# EAGLE design sega (EAGLE 8.0.0)
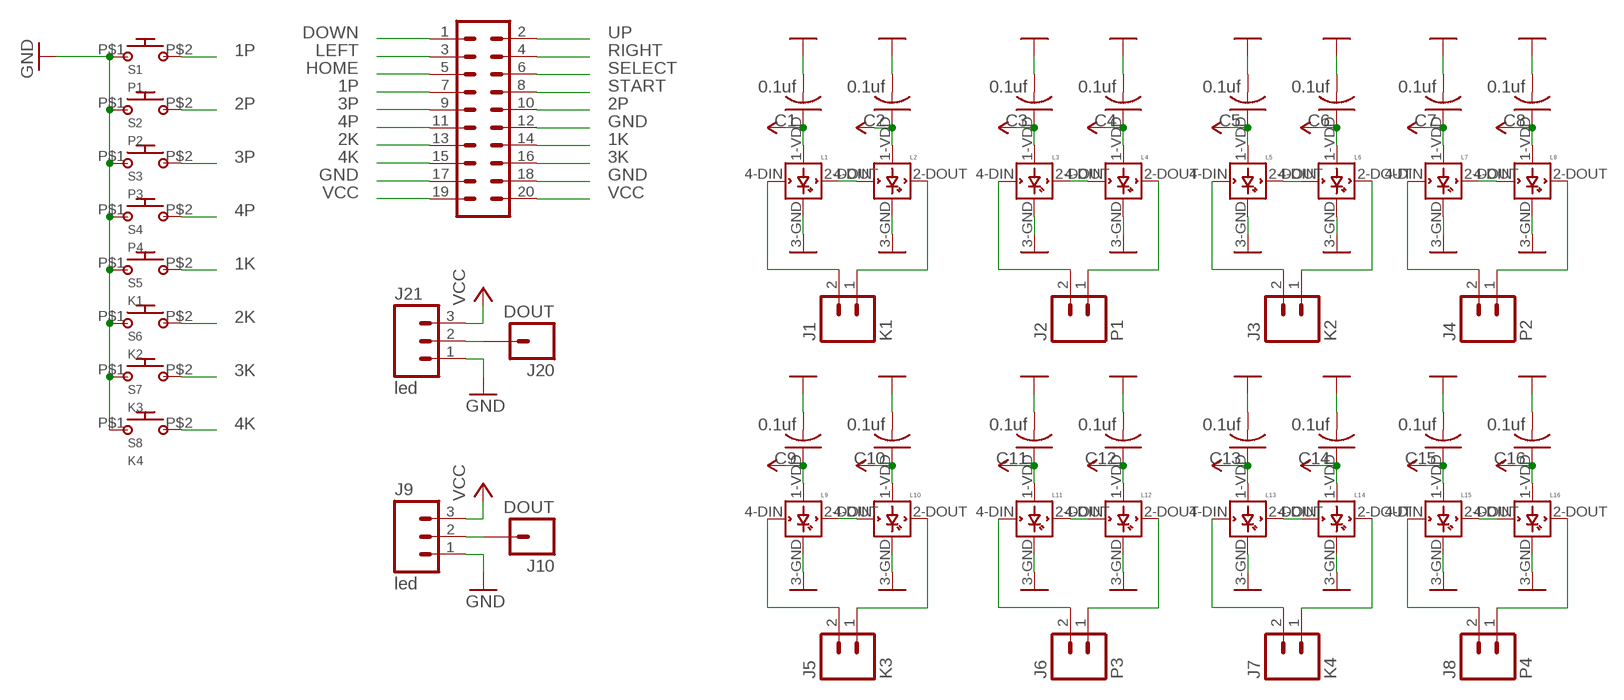
[diagram p0: schematic, sheet 1]

## Parts
C1  0.1uf  C-USC0603K  [C0603K]
C2  0.1uf  C-USC0603K  [C0603K]
C3  0.1uf  C-USC0603K  [C0603K]
C4  0.1uf  C-USC0603K  [C0603K]
C5  0.1uf  C-USC0603K  [C0603K]
C6  0.1uf  C-USC0603K  [C0603K]
C7  0.1uf  C-USC0603K  [C0603K]
C8  0.1uf  C-USC0603K  [C0603K]
C9  0.1uf  C-USC0603K  [C0603K]
C10  0.1uf  C-USC0603K  [C0603K]
C11  0.1uf  C-USC0603K  [C0603K]
C12  0.1uf  C-USC0603K  [C0603K]
C13  0.1uf  C-USC0603K  [C0603K]
C14  0.1uf  C-USC0603K  [C0603K]
C15  0.1uf  C-USC0603K  [C0603K]
C16  0.1uf  C-USC0603K  [C0603K]
J1  K1  M02PTH  [1X02]
J2  P1  M02PTH  [1X02]
J3  K2  M02PTH  [1X02]
J4  P2  M02PTH  [1X02]
J5  K3  M02PTH  [1X02]
J6  P3  M02PTH  [1X02]
J7  K4  M02PTH  [1X02]
J8  P4  M02PTH  [1X02]
J9  led  M03JST-PTH-VERT  [JST-3-PTH-VERT]
J10  DOUT  M01PTH  [1X01]
J20  DOUT  M01PTH  [1X01]
J21  led  M03JST-PTH-VERT  [JST-3-PTH-VERT]
L1  WS2812B  [WS2812B]
L2  WS2812B  [WS2812B]
L3  WS2812B  [WS2812B]
L4  WS2812B  [WS2812B]
L5  WS2812B  [WS2812B]
L6  WS2812B  [WS2812B]
L7  WS2812B  [WS2812B]
L8  WS2812B  [WS2812B]
L9  WS2812B  [WS2812B]
L10  WS2812B  [WS2812B]
L11  WS2812B  [WS2812B]
L12  WS2812B  [WS2812B]
L13  WS2812B  [WS2812B]
L14  WS2812B  [WS2812B]
L15  WS2812B  [WS2812B]
L16  WS2812B  [WS2812B]
S1  P1  SANWA_OBSC_24_CW  [SANWA_24MM]
S2  P2  SANWA_OBSC_24_CW  [SANWA_24MM]
S3  P3  SANWA_OBSC_24_CW  [SANWA_24MM]
S4  P4  SANWA_OBSC_24_CW  [SANWA_24MM]
S5  K1  SANWA_OBSC_24_CW  [SANWA_24MM]
S6  K2  SANWA_OBSC_24_CW  [SANWA_24MM]
S7  K3  SANWA_OBSC_24_CW  [SANWA_24MM]
S8  K4  SANWA_OBSC_24_CW  [SANWA_24MM]
U$1  M10X2ROUND_NOSILK  [2X10_ROUND_NOSILK]

## Nets
1K: S5.P$2 U$1.14
1P: S1.P$2 U$1.7
2K: S6.P$2 U$1.13
2P: S2.P$2 U$1.10
3K: S7.P$2 U$1.16
3P: S3.P$2 U$1.9
4K: S8.P$2 U$1.15
4P: S4.P$2 U$1.11
DOWN: U$1.1
GND: C1.2 C2.2 C3.2 C4.2 C5.2 C6.2 C7.2 C8.2 C9.2 C10.2 C11.2 C12.2 C13.2 C14.2 C15.2 C16.2 J9.1 J21.1 L1.3-GND(GND) L2.3-GND(GND) L3.3-GND(GND) L4.3-GND(GND) L5.3-GND(GND) L6.3-GND(GND) L7.3-GND(GND) L8.3-GND(GND) L9.3-GND(GND) L10.3-GND(GND) L11.3-GND(GND) L12.3-GND(GND) L13.3-GND(GND) L14.3-GND(GND) L15.3-GND(GND) L16.3-GND(GND) S1.P$1 S2.P$1 S3.P$1 S4.P$1 S5.P$1 S6.P$1 S7.P$1 S8.P$1 U$1.12 U$1.17 U$1.18
HOME: U$1.5
LEFT: U$1.3
N$1: J1.2 L1.4-DIN(DIN)
N$2: J1.1 L2.2-DOUT(DOUT)
N$3: L1.2-DOUT(DOUT) L2.4-DIN(DIN)
N$4: J20.1 J21.2
N$5: J2.2 L3.4-DIN(DIN)
N$6: J2.1 L4.2-DOUT(DOUT)
N$7: J3.2 L5.4-DIN(DIN)
N$8: L5.2-DOUT(DOUT) L6.4-DIN(DIN)
N$9: J3.1 L6.2-DOUT(DOUT)
N$10: J4.2 L7.4-DIN(DIN)
N$11: J4.1 L8.2-DOUT(DOUT)
N$12: J5.2 L9.4-DIN(DIN)
N$13: J5.1 L10.2-DOUT(DOUT)
N$14: J6.2 L11.4-DIN(DIN)
N$15: J6.1 L12.2-DOUT(DOUT)
N$16: J7.2 L13.4-DIN(DIN)
N$17: J7.1 L14.2-DOUT(DOUT)
N$18: L9.2-DOUT(DOUT) L10.4-DIN(DIN)
N$19: L11.2-DOUT(DOUT) L12.4-DIN(DIN)
N$20: L13.2-DOUT(DOUT) L14.4-DIN(DIN)
N$21: L15.2-DOUT(DOUT) L16.4-DIN(DIN)
N$22: L7.2-DOUT(DOUT) L8.4-DIN(DIN)
N$23: L3.2-DOUT(DOUT) L4.4-DIN(DIN)
N$24: J8.2 L15.4-DIN(DIN)
N$25: J8.1 L16.2-DOUT(DOUT)
N$27: J9.2 J10.1
RIGHT: U$1.4
SELECT: U$1.6
START: U$1.8
UP: U$1.2
VCC: C1.1 C2.1 C3.1 C4.1 C5.1 C6.1 C7.1 C8.1 C9.1 C10.1 C11.1 C12.1 C13.1 C14.1 C15.1 C16.1 J9.3 J21.3 L1.1-VDD(VDD) L2.1-VDD(VDD) L3.1-VDD(VDD) L4.1-VDD(VDD) L5.1-VDD(VDD) L6.1-VDD(VDD) L7.1-VDD(VDD) L8.1-VDD(VDD) L9.1-VDD(VDD) L10.1-VDD(VDD) L11.1-VDD(VDD) L12.1-VDD(VDD) L13.1-VDD(VDD) L14.1-VDD(VDD) L15.1-VDD(VDD) L16.1-VDD(VDD) U$1.19 U$1.20

## Library data of the parts
C1-C16 = rcl:C-US: CAPACITOR, American symbol
J1-J8 = SparkFun-Connectors:M02: Standard 2-pin 0.1" header. Use with - straight break away headers ( PRT-00116) - right angle break away headers (PRT-00553) - swiss pins (PRT-00743) - machine pins (PRT-00117) - female headers (PRT-00115) Molex polarized connector foot print use with: PRT-08233 with associated crimp pins and housings. 2.54_SCREWTERM for use with PRT-10571. 3.5mm Screw Terminal footprints for PRT-08084 5mm Screw Terminal footprints for use with PRT-08432
J9 J21 = SparkFun-Connectors:M03: Header 3 Standard 3-pin 0.1" header. Use with straight break away headers (SKU : PRT-00116), right angle break away headers (PRT-00553), swiss pins (PRT-00743), machine pins (PRT-00117), and female headers (PRT-00115). Molex polarized connector foot print use with SKU : PRT-08232 with associated crimp pins and housings.
J10 J20 = SparkFun-Connectors:M01: Header 1 Standard 1-pin 0.1" header. Use with straight break away headers (SKU : PRT-00116), right angle break away headers (PRT-00553), swiss pins (PRT-00743), machine pins (PRT-00117), and female headers (PRT-00115). SMTSO-256-ET is a "flush mount" nut for a 4-40 screw. The older package used to be too tight, and did not allow it to sit properly thru the drill hit. The latest (0.165DIA) fits nice and snug.
L1-L16 = adafruit:WS2812B
S1-S8 = arcaduinome:SANWA_OBSC_24_CW: Sanwa OBSC 24mm CW A 24mm arcade-style push button with clear casings and a white plunger.
U$1 = SparkFun-Connectors:M10X2: This was SPECIALLY designed to be used with our Graphic LCD Backpack. Be sure you want to use this! It is not only staggered on each line of header holes, but IT IS ALSO offset of the center point of the top and bottom lines by 5 mil. This causes the headers to lock into place on the "standard" footprint on the LCD screen. The extra squares on the tdocu layer are there simply to reference other pins (if you were to actually populate a longer header than ten long - this is what we do with the backpacks).

## Board
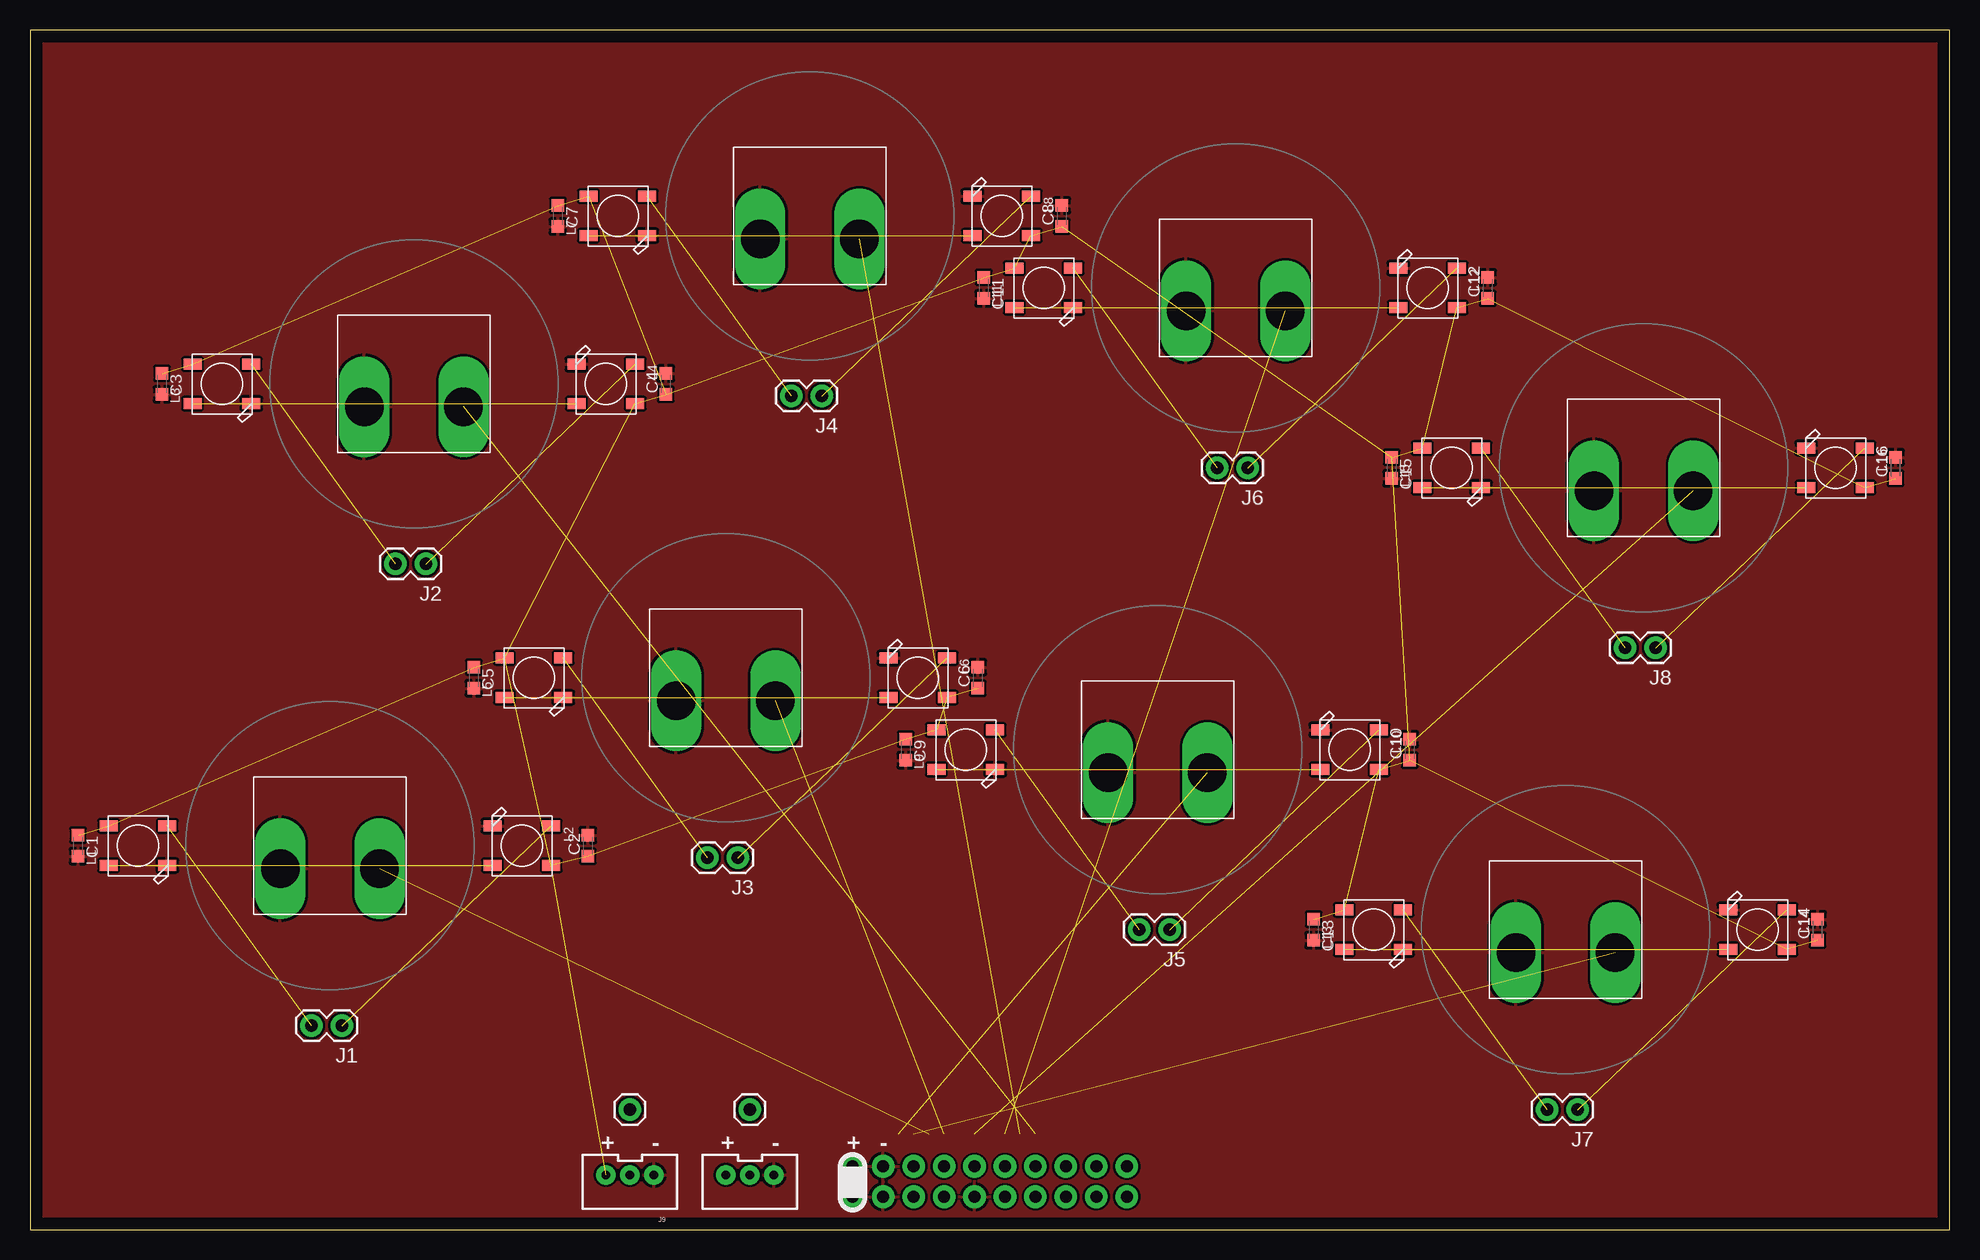
[diagram p1: board, top side]
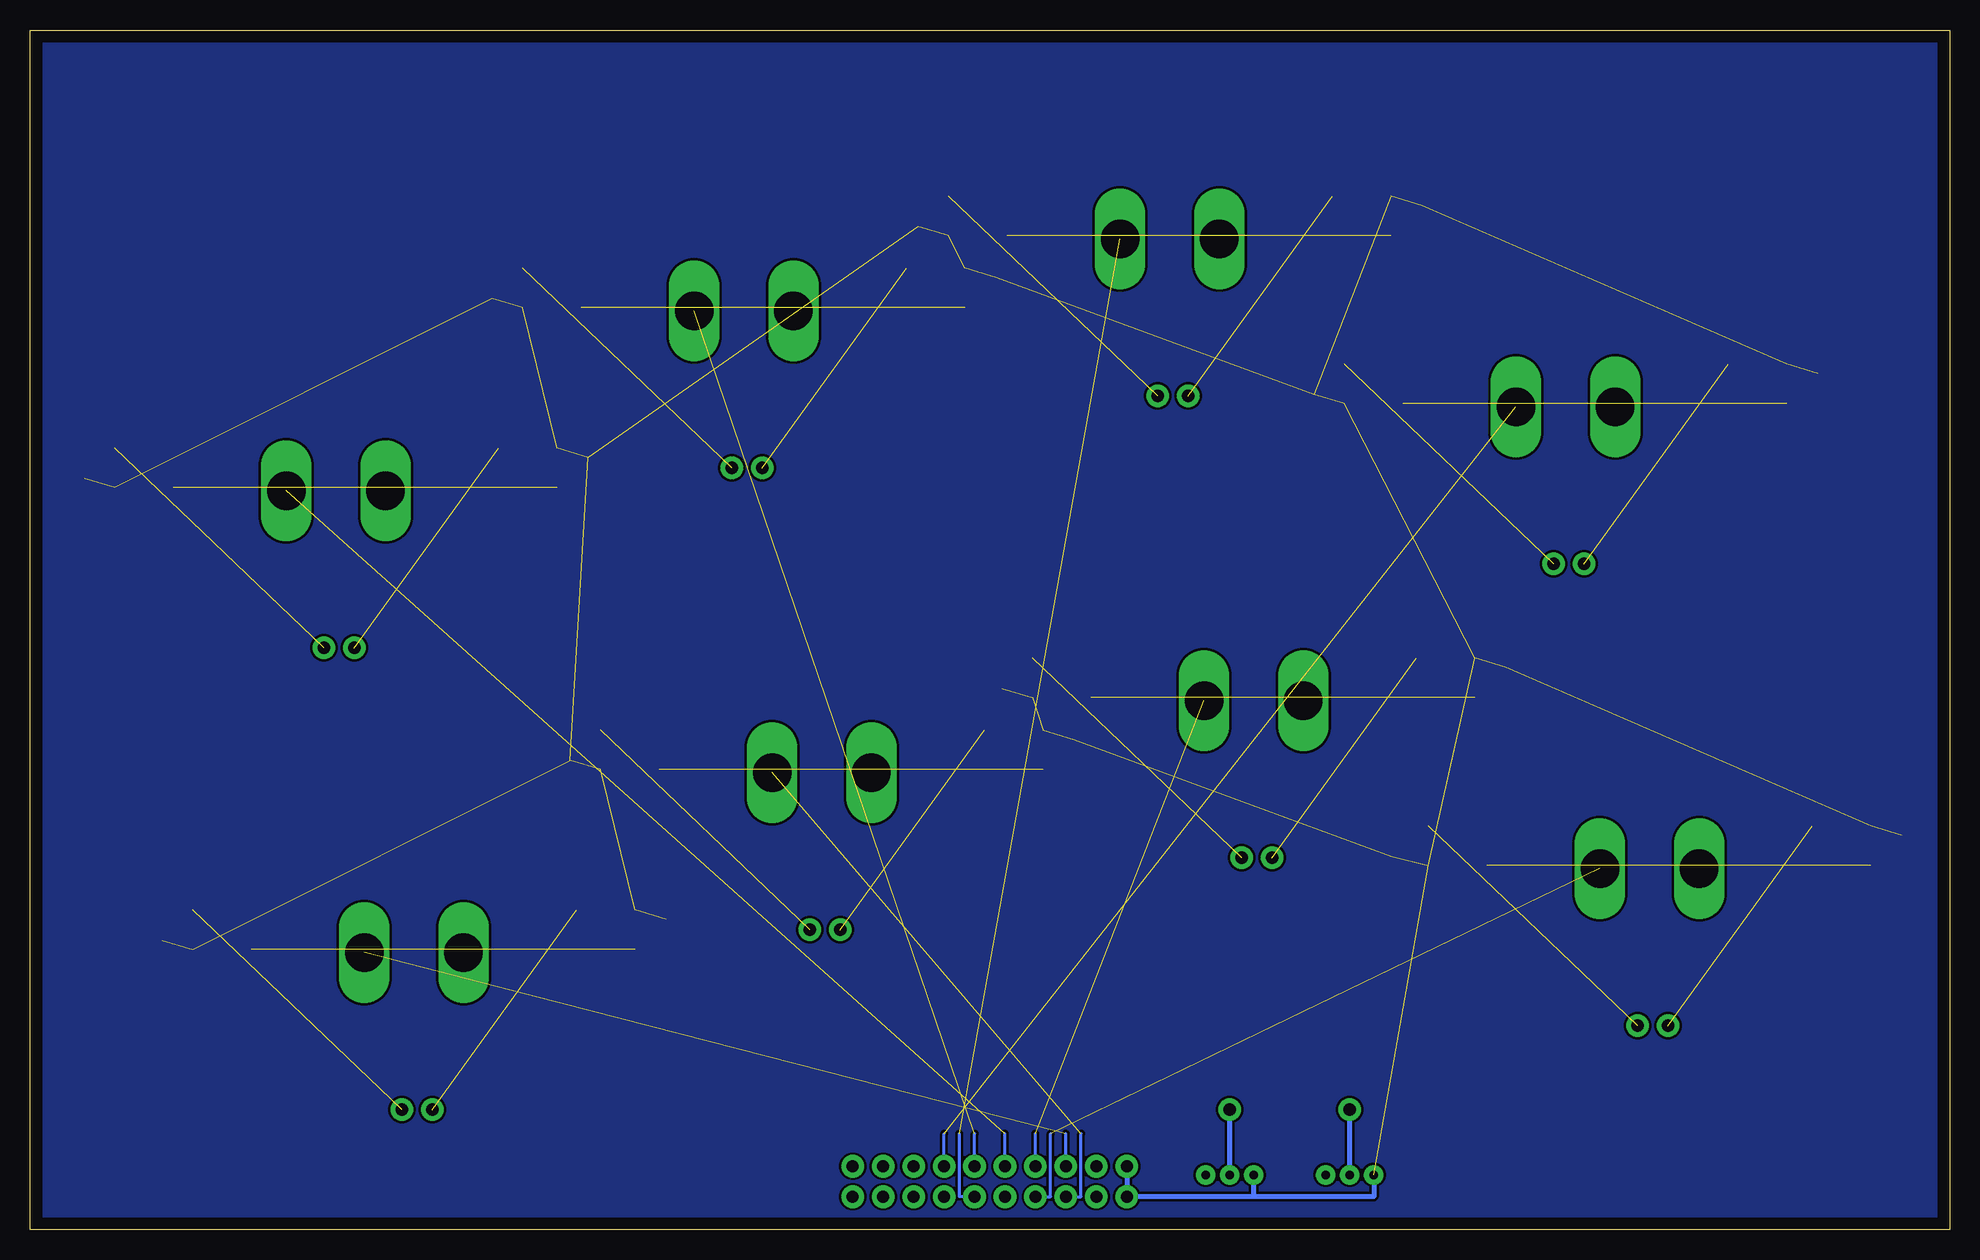
[diagram p2: board, bottom side, seen from below]

Size 160 x 100 mm. Coordinates in mm from the lower left corner, seen from the top.
Outline: 0,0 160,0 160,100 0,100 0,0
Copper layers (1*16): Top 0.035mm / dielectric 1.5mm / Bottom 0.035mm
Design rules "default": minimum track width 10mil, minimum drill 24mil, track to track 8mil, track to pad 8mil, pad to pad 8mil, via to via 8mil, smd to smd 8mil, copper to edge 40mil, drill to drill 8mil, minimum pad ring 10mil, minimum via ring 8mil, stop-mask expansion 4mil, vias tented up to drill 0mil, thermal gap 10mil

### Footprints (pad centres in the part's own frame; a part is rotated, then mirrored left to right if it is on the bottom)
C0603K = smd 1.05 x 1.08: 1 -0.875,0; 2 0.875,0
1X02 = drill 1.016 pad 1.88: 1 0,0; 2 2.54,0
JST-3-PTH-VERT = drill 0.7 pad 1.6: 1 -2,-0.55; 2 0,-0.55; 3 2,-0.55
1X01 = drill 1.016 pad 1.88: 1 0,0
WS2812B = smd 1.5 x 0.9: 1-VDD 2.45,-1.65; 2-DOUT 2.45,1.65; 3-GND -2.45,1.65; 4-DIN -2.45,-1.65
SANWA_24MM = drill 3.2 long: P$1 -4.128,-1.905; P$2 4.128,-1.905
2X10_ROUND_NOSILK = drill 1.016 pad 1.88: 1 -11.43,-1.27; 2 -11.43,1.27; 3 -8.89,-1.27; 4 -8.89,1.27; 5 -6.35,-1.27; 6 -6.35,1.27; 7 -3.81,-1.27; 8 -3.81,1.27; 9 -1.27,-1.27; 10 -1.27,1.27; 11 1.27,-1.27; 12 1.27,1.27; 13 3.81,-1.27; 14 3.81,1.27; 15 6.35,-1.27; 16 6.35,1.27; 17 8.89,-1.27; 18 8.89,1.27; 19 11.43,-1.27; 20 11.43,1.27

### Placement (x,y rotation side)
C1  4,32 270 top
C2  46.5,32 90 top
C3  11,70.5 270 top
C4  53,70.5 90 top
C5  37,46 270 top
C6  79,46 90 top
C7  44,84.5 270 top
C8  86,84.5 90 top
C9  73,40 270 top
C10  115,40 90 top
C11  79.5,78.5 270 top
C12  121.5,78.5 90 top
C13  107,25 270 top
C14  149,25 90 top
C15  113.5,63.5 270 top
C16  155.5,63.5 90 top
J1  26,17 180 top
J2  33,55.5 180 top
J3  59,31 180 top
J4  66,69.5 180 top
J5  95,25 180 top
J6  101.5,63.5 180 top
J7  129,10 180 top
J8  135.5,48.5 180 top
J9  50,4 180 top
J10  50,10 180 top
J20  60,10 180 top
J21  60,4 180 top
L1  9,32 180 top
L2  41,32 0 top
L3  16,70.5 180 top
L4  48,70.5 0 top
L5  42,46 180 top
L6  74,46 0 top
L7  49,84.5 180 top
L8  81,84.5 0 top
L9  78,40 180 top
L10  110,40 0 top
L11  84.5,78.5 180 top
L12  116.5,78.5 0 top
L13  112,25 180 top
L14  144,25 0 top
L15  118.5,63.5 180 top
L16  150.5,63.5 0 top
S1  32,70.5 0 top
S2  65,84.5 0 top
S3  100.5,78.5 0 top
S4  134.5,63.5 0 top
S5  25,32 0 top
S6  58,46 0 top
S7  94,40 0 top
S8  128,25 0 top
U$1  80,4 180 top

### Tracks (layer width: path | path; a pad name or v marks a point on that pad's centre or on a via)
1K  (1 unrouted)
  Bottom 0.254: U$1.14 74.92,2.73 74.92,8
1P  (1 unrouted)
  Bottom 0.254: U$1.7 83.81,8
2K  (1 unrouted)
  Bottom 0.254: U$1.13 76.19,8
2P  (1 unrouted)
  Bottom 0.254: U$1.10 82.54,2.73 82.54,8
3K  (1 unrouted)
  Bottom 0.254: U$1.16 72.38,2.73 72.38,8
3P  (1 unrouted)
  Bottom 0.254: U$1.9 81.27,8
4K  (1 unrouted)
  Bottom 0.254: U$1.15 73.65,8
4P  (1 unrouted)
  Bottom 0.254: U$1.11 78.73,8
GND
  pour Top: 0,100 160,100 160,0 0,0
N$1  (1 unrouted)
N$2  (1 unrouted)
N$3  (1 unrouted)
N$4
  Bottom 0.406: J21.2 J20.1
N$5  (1 unrouted)
N$6  (1 unrouted)
N$7  (1 unrouted)
N$8  (1 unrouted)
N$9  (1 unrouted)
N$10  (1 unrouted)
N$11  (1 unrouted)
N$12  (1 unrouted)
N$13  (1 unrouted)
N$14  (1 unrouted)
N$15  (1 unrouted)
N$16  (1 unrouted)
N$17  (1 unrouted)
N$18  (1 unrouted)
N$19  (1 unrouted)
N$20  (1 unrouted)
N$21  (1 unrouted)
N$22  (1 unrouted)
N$23  (1 unrouted)
N$24  (1 unrouted)
N$25  (1 unrouted)
N$26
  pour Bottom: 0,100 160,100 160,0 0,0
N$27
  Bottom 0.406: J9.2 J10.1
VCC  (32 unrouted)
  Bottom 0.406: U$1.19 U$1.20 58,2.73 | 58,2.73 J21.3 | J9.3 48,2.73 58,2.73

### Text on the board
tPlace: + | - | + | - | + | -